# EAGLE schematic jar (EAGLE 6.5.0)
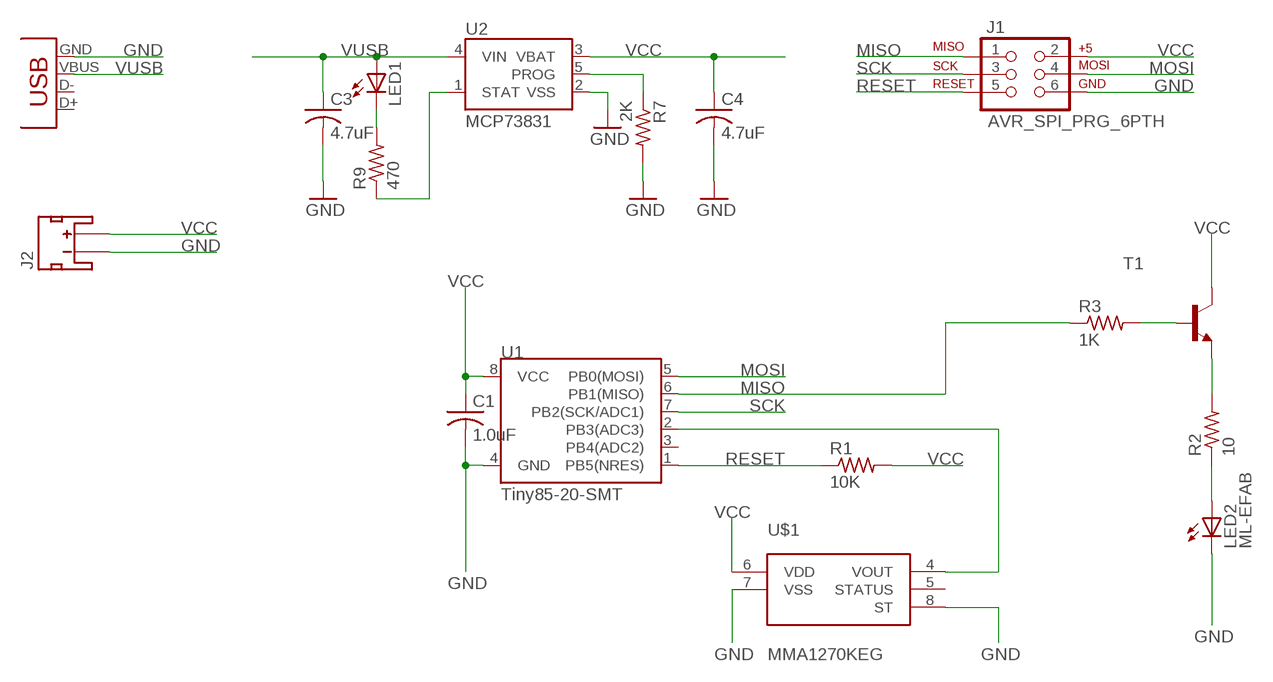
[diagram p0: schematic, sheet 1]

## Parts
C1  1.0uF  C-USC1206  [C1206]
C3  4.7uF  C-USC1206  [C1206]
C4  4.7uF  C-USC1206  [C1206]
J1  AVR_SPI_PRG_6PTH  [2X3]
J2  JST_2MM_MALE  [JST-2-SMD]
JP1  USB-B-VERTICAL  [USB_MINIB_VERTICAL]
LED1  LEDSMT1206  [1206]
LED2  ML-EFAB  [ML-E-FAB]
R1  10K  R-US_R1206  [R1206]
R2  10  R-US_R1206  [R1206]
R3  1K  R-US_R1206  [R1206]
R7  2K  R-US_R1206  [R1206]
R9  470  R-US_R1206  [R1206]
T1  MMBT3904LT1-NPN-SOT23-BEC  [SOT23-BEC]
U1  Tiny85-20-SMT  ATTINY45TINY85-20-SMT  [SO08-EIAJ]
U2  MCP73831  [SOT23-5]
U$1  MMA1270KEG  [SOIC16]

## Nets
GND [power]: C1.2 C3.2 C4.2 J1.6 J2.1(-) JP1.GND LED2.C@1(C) R7.2 U1.4(GND) U2.2(VSS) U$1.7(VSS) U$1.8(ST)
MISO: J1.1 R3.1 U1.6(PB1(MISO))
MOSI: J1.4 U1.5(PB0(MOSI))
N$1: R2.2 T1.E
N$2: R3.2 T1.B
N$3: LED2.A@1(A) R2.1
N$7: U1.2(PB3(ADC3)) U$1.4(VOUT)
N$35: R9.1 U2.1(STAT)
N$36: LED1.C R9.2
PROG: R7.1 U2.5(PROG)
RESET: J1.5 R1.1 U1.1(PB5(NRES))
SCK: J1.3 U1.7(PB2(SCK/ADC1))
VCC [power]: C1.1 C4.1 J1.2 J2.2(+) R1.2 T1.C U1.8(VCC) U2.3(VBAT) U$1.6(VDD)
VUSB [power]: C3.1 JP1.VBUS LED1.A U2.4(VIN)
Unconnected: J2.NC1(PAD1) J2.NC2(PAD2) JP1.D+ JP1.D- LED2.A@2(A) LED2.C@2(C) LED2.TH U1.3(PB4(ADC2)) U$1.5(STATUS)

## Library data of the parts
C1 C3 C4 = rcl:C-US: CAPACITOR, American symbol
J1 = SparkFun-Connectors:AVR_SPI_PRG_6: AVR ISP 6 Pin This is the reduced ISP connector for AVR programming. Common on Arduino. This footprint will take up less PCB space and can be used with a 10-pin to 6-pin adapter such as SKU: BOB-08508 **Special note about "TEST_POINT" package. The stop mask is on the top side, so if you want your programming test points to be on the bottom of your board, make sure to place this package on the bottom side of the board. This also ensure that the orientation to program from the bottom side will be correct.
J2 = SparkFun-Connectors:JST_2MM_MALE: Mates to single-cell LiPo batteries. CONN-08352; PROD_ID: CONN-08352
JP1 = LED Light:USB
LED1 = cellphone-led:LED: LED OSRAM: - CHIPLED LG R971, LG N971, LY N971, LG Q971, LY Q971, LO R971, LY R971 LH N974, LH R974 LS Q976, LO Q976, LY Q976 LO Q996 - Hyper CHIPLED LW Q18S LB Q993, LB Q99A, LB R99A - SideLED LS A670, LO A670, LY A670, LG A670, LP A670 LB A673, LV A673, LT A673, LW A673 LH A674 LY A675 LS A676, LA A676, LO A676, LY A676, LW A676 LS A679, LY A679, LG A679 - Hyper Micro SIDELED® LS Y876, LA Y876, LO Y876, LY Y876 LT Y87S - SmartLED LW L88C, LW L88S LB L89C, LB L89S, LG L890 LS L89K, LO L89K, LY L89K LS L896, LA L896, LO L896, LY L896 - TOPLED LS T670, LO T670, LY T670, LG T670, LP T670 LSG T670, LSP T670, LSY T670, LOP T670, LYG T670 LG T671, LOG T671, LSG T671 LB T673, LV T673, LT T673, LW T673 LH T674 LS T676, LA T676, LO T676, LY T676, LB T676, LH T676, LSB T676, LW T676 LB T67C, LV T67C, LT T67C, LS T67K, LO T67K, LY T67K, LW E67C LS E67B, LA E67B, LO E67B, LY E67B, LB E67C, LV E67C, LT E67C LW T67C LS T679, LY T679, LG T679 LS T770, LO T770, LY T770, LG T770, LP T770 LB T773, LV T773, LT T773, LW T773 LH T774 LS E675, LA E675, LY E675, LS T675 LS T776, LA T776, LO T776, LY T776, LB T776 LHGB T686 LT T68C, LB T68C - Hyper Mini TOPLED® LB M676 - Mini TOPLED Santana® LG M470 LS M47K, LO M47K, LY M47K Source: http://www.osram.convergy.de LUXEON: - LUMILED® LXK2-PW12-R00, LXK2-PW12-S00, LXK2-PW14-U00, LXK2-PW14-V00 LXK2-PM12-R00, LXK2-PM12-S00, LXK2-PM14-U00 LXK2-PE12-Q00, LXK2-PE12-R00, LXK2-PE12-S00, LXK2-PE14-T00, LXK2-PE14-U00 LXK2-PB12-K00, LXK2-PB12-L00, LXK2-PB12-M00, LXK2-PB14-N00, LXK2-PB14-P00, LXK2-PB14-Q00 LXK2-PR12-L00, LXK2-PR12-M00, LXK2-PR14-Q00, LXK2-PR14-R00 LXK2-PD12-Q00, LXK2-PD12-R00, LXK2-PD12-S00 LXK2-PH12-R00, LXK2-PH12-S00 LXK2-PL12-P00, LXK2-PL12-Q00, LXK2-PL12-R00 Source: www.luxeon.com KINGBRIGHT: KA-3528ASYC Source: www.kingbright.com
LED2 = LED Light:ML-E: Cree® XLamp® ML-E LEDs 1/2 watt, 3.5 x 3.5 mm Source: Data sheet <http://www.cree.com/products/pdf/XLampML-E.pdf>
R1-R3 R7 R9 = rcl:R-US_: RESISTOR, American symbol
T1 = transistor:*-NPN-: NPN Transistror BF959 corrected 2008.03.06
U1 = SparkFun-DigitalIC:ATTINY45: Atmel 8-pin 2/4/8kB flash uC; PROD_ID: IC-09092
U2 = SparkFun-PowerIC:MCP73831: Miniature single cell, fully integrated Li-Ion, Li-polymer charge management controller http://ww1.microchip.com/downloads/en/DeviceDoc/21984a.pdf IC-09995; PROD_ID: IC-09995
U$1 = LED Light:MMA1270KEG

## Net classes
1 power: width 0.406 mm